# Altium schematic sheet RK3399_SDRAM_Controller.SchDoc
size A3; SheetNumber: 6; SheetTotal: 20
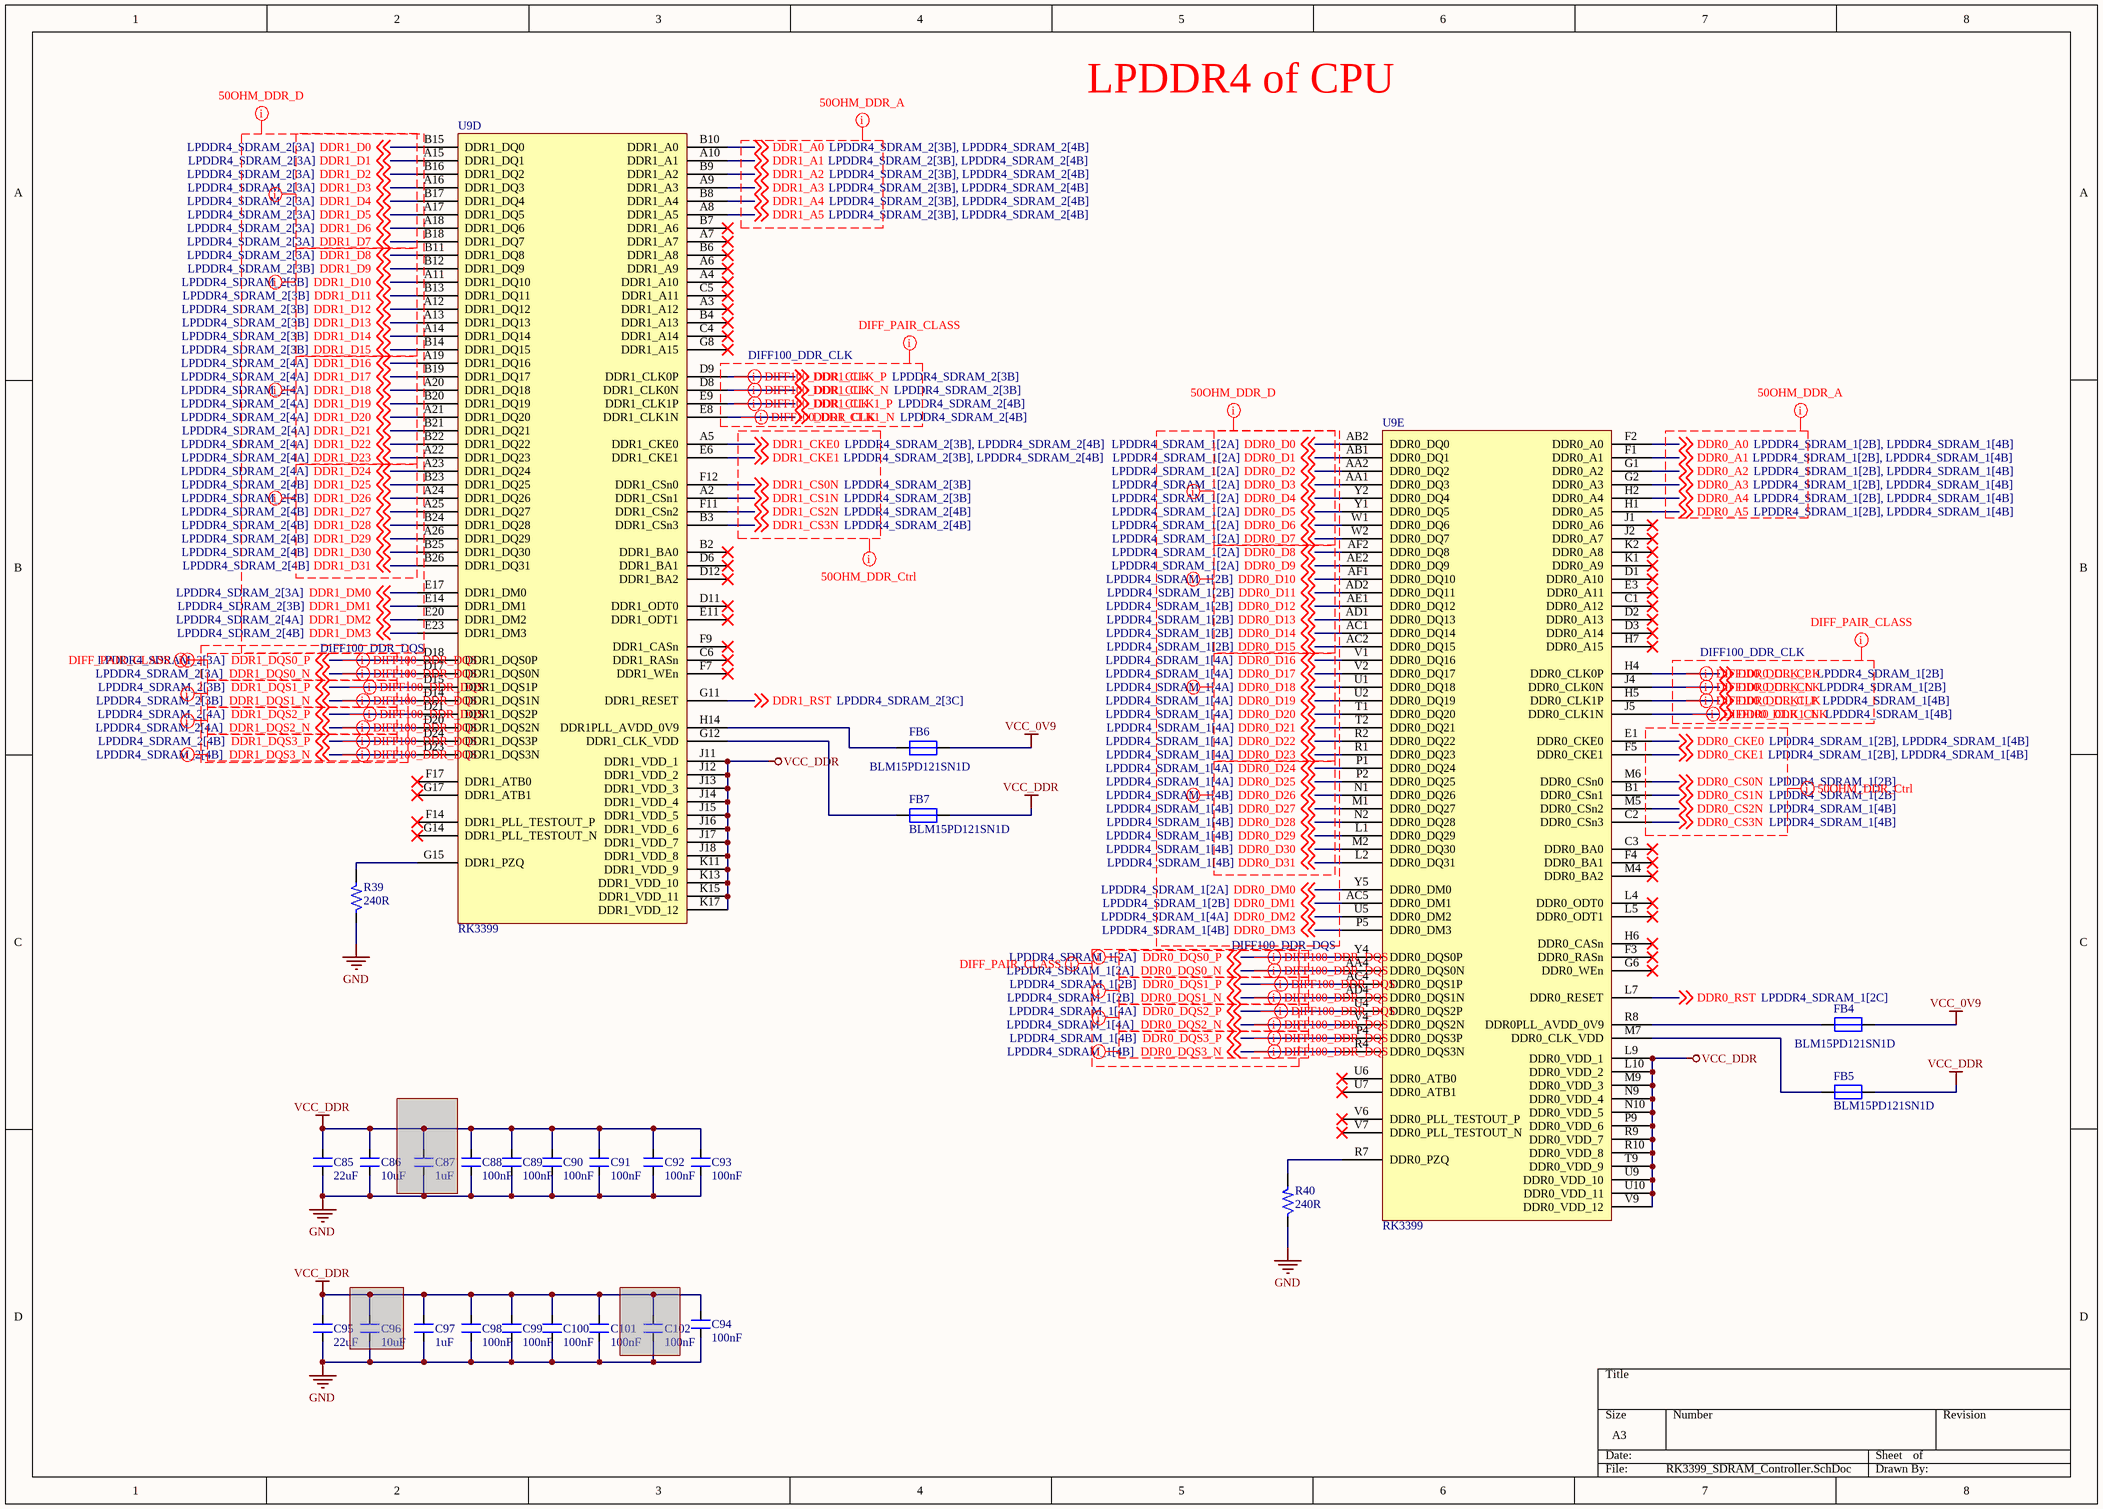
[diagram p0: RK3399_SDRAM_Controller.SchDoc]

## Parts
C85  22uF  [CAP_0402]
C86  10uF  [CAP_0402]
C87  1uF  [CAP_0201]  (masked out: inside a compile mask, not in the netlist)
C88  100nF  [CAP_0201]
C89  100nF  [CAP_0201]
C90  100nF  [CAP_0201]
C91  100nF  [CAP_0201]
C92  100nF  [CAP_0201]
C93  100nF  [CAP_0201]
C94  100nF  [CAP_0201]
C95  22uF  [CAP_0402]
C96  10uF  [CAP_0402]  (masked out: inside a compile mask, not in the netlist)
C97  1uF  [CAP_0201]
C98  100nF  [CAP_0201]
C99  100nF  [CAP_0201]
C100  100nF  [CAP_0201]
C101  100nF  [CAP_0201]
C102  100nF  [CAP_0201]  (masked out: inside a compile mask, not in the netlist)
FB4  BLM15PD121SN1D  [RES_0402]
FB5  BLM15PD121SN1D  [RES_0402]
FB6  BLM15PD121SN1D  [RES_0402]
FB7  BLM15PD121SN1D  [RES_0402]
R39  240R  [RES_0201]
R40  240R  [RES_0201]
U9  RK3399  [FBGA828_23_826X826]  (parts D,E of 24)

## Nets
GND: C85.1 C86.1 C88.1 C89.1 C90.1 C91.1 C92.1 C93.1 C94.1 C95.1 C97.1 C98.1 C99.1 C100.1 C101.1 R39.1 R40.1
VCC_0V9: FB4.2 FB6.2
VCC_DDR: C85.2 C86.2 C88.2 C89.2 C90.2 C91.2 C92.2 C93.2 C94.2 C95.2 C97.2 C98.2 C99.2 C100.2 C101.2 FB5.2 FB7.2 U9.J11(DDR1_VDD_1) U9.J12(DDR1_VDD_2) U9.J13(DDR1_VDD_3) U9.J14(DDR1_VDD_4) U9.J15(DDR1_VDD_5) U9.J16(DDR1_VDD_6) U9.J17(DDR1_VDD_7) U9.J18(DDR1_VDD_8) U9.K11(DDR1_VDD_9) U9.K13(DDR1_VDD_10) U9.K15(DDR1_VDD_11) U9.K17(DDR1_VDD_12) U9.L9(DDR0_VDD_1) U9.L10(DDR0_VDD_2) U9.M9(DDR0_VDD_3) U9.N9(DDR0_VDD_4) U9.N10(DDR0_VDD_5) U9.P9(DDR0_VDD_6) U9.R9(DDR0_VDD_7) U9.R10(DDR0_VDD_8) U9.T9(DDR0_VDD_9) U9.U9(DDR0_VDD_10) U9.U10(DDR0_VDD_11) U9.V9(DDR0_VDD_12)
DDR0_A0: U9.F2(DDR0_A0) ; off-sheet DDR0_A0
DDR0_A1: U9.F1(DDR0_A1) ; off-sheet DDR0_A1
DDR0_A2: U9.G1(DDR0_A2) ; off-sheet DDR0_A2
DDR0_A3: U9.G2(DDR0_A3) ; off-sheet DDR0_A3
DDR0_A4: U9.H2(DDR0_A4) ; off-sheet DDR0_A4
DDR0_A5: U9.H1(DDR0_A5) ; off-sheet DDR0_A5
DDR0_CKE0: U9.E1(DDR0_CKE0) ; off-sheet DDR0_CKE0
DDR0_CKE1: U9.F5(DDR0_CKE1) ; off-sheet DDR0_CKE1
DDR0_CLK1_N: U9.J5(DDR0_CLK1N) ; off-sheet DDR0_CLK1_N
DDR0_CLK1_P: U9.H5(DDR0_CLK1P) ; off-sheet DDR0_CLK1_P
DDR0_CLK_N: U9.J4(DDR0_CLK0N) ; off-sheet DDR0_CLK_N
DDR0_CLK_P: U9.H4(DDR0_CLK0P) ; off-sheet DDR0_CLK_P
DDR0_CS0N: U9.M6(DDR0_CSn0) ; off-sheet DDR0_CS0N
DDR0_CS1N: U9.B1(DDR0_CSn1) ; off-sheet DDR0_CS1N
DDR0_CS2N: U9.M5(DDR0_CSn2) ; off-sheet DDR0_CS2N
DDR0_CS3N: U9.C2(DDR0_CSn3) ; off-sheet DDR0_CS3N
DDR0_D0: U9.AB2(DDR0_DQ0) ; off-sheet DDR0_D0
DDR0_D1: U9.AB1(DDR0_DQ1) ; off-sheet DDR0_D1
DDR0_D2: U9.AA2(DDR0_DQ2) ; off-sheet DDR0_D2
DDR0_D3: U9.AA1(DDR0_DQ3) ; off-sheet DDR0_D3
DDR0_D4: U9.Y2(DDR0_DQ4) ; off-sheet DDR0_D4
DDR0_D5: U9.Y1(DDR0_DQ5) ; off-sheet DDR0_D5
DDR0_D6: U9.W1(DDR0_DQ6) ; off-sheet DDR0_D6
DDR0_D7: U9.W2(DDR0_DQ7) ; off-sheet DDR0_D7
DDR0_D8: U9.AF2(DDR0_DQ8) ; off-sheet DDR0_D8
DDR0_D9: U9.AE2(DDR0_DQ9) ; off-sheet DDR0_D9
DDR0_D10: U9.AF1(DDR0_DQ10) ; off-sheet DDR0_D10
DDR0_D11: U9.AD2(DDR0_DQ11) ; off-sheet DDR0_D11
DDR0_D12: U9.AE1(DDR0_DQ12) ; off-sheet DDR0_D12
DDR0_D13: U9.AD1(DDR0_DQ13) ; off-sheet DDR0_D13
DDR0_D14: U9.AC1(DDR0_DQ14) ; off-sheet DDR0_D14
DDR0_D15: U9.AC2(DDR0_DQ15) ; off-sheet DDR0_D15
DDR0_D16: U9.V1(DDR0_DQ16) ; off-sheet DDR0_D16
DDR0_D17: U9.V2(DDR0_DQ17) ; off-sheet DDR0_D17
DDR0_D18: U9.U1(DDR0_DQ18) ; off-sheet DDR0_D18
DDR0_D19: U9.U2(DDR0_DQ19) ; off-sheet DDR0_D19
DDR0_D20: U9.T1(DDR0_DQ20) ; off-sheet DDR0_D20
DDR0_D21: U9.T2(DDR0_DQ21) ; off-sheet DDR0_D21
DDR0_D22: U9.R2(DDR0_DQ22) ; off-sheet DDR0_D22
DDR0_D23: U9.R1(DDR0_DQ23) ; off-sheet DDR0_D23
DDR0_D24: U9.P1(DDR0_DQ24) ; off-sheet DDR0_D24
DDR0_D25: U9.P2(DDR0_DQ25) ; off-sheet DDR0_D25
DDR0_D26: U9.N1(DDR0_DQ26) ; off-sheet DDR0_D26
DDR0_D27: U9.M1(DDR0_DQ27) ; off-sheet DDR0_D27
DDR0_D28: U9.N2(DDR0_DQ28) ; off-sheet DDR0_D28
DDR0_D29: U9.L1(DDR0_DQ29) ; off-sheet DDR0_D29
DDR0_D30: U9.M2(DDR0_DQ30) ; off-sheet DDR0_D30
DDR0_D31: U9.L2(DDR0_DQ31) ; off-sheet DDR0_D31
DDR0_DM0: U9.Y5(DDR0_DM0) ; off-sheet DDR0_DM0
DDR0_DM1: U9.AC5(DDR0_DM1) ; off-sheet DDR0_DM1
DDR0_DM2: U9.U5(DDR0_DM2) ; off-sheet DDR0_DM2
DDR0_DM3: U9.P5(DDR0_DM3) ; off-sheet DDR0_DM3
DDR0_DQS0_N: U9.AA4(DDR0_DQS0N) ; off-sheet DDR0_DQS0_N
DDR0_DQS0_P: U9.Y4(DDR0_DQS0P) ; off-sheet DDR0_DQS0_P
DDR0_DQS1_N: U9.AD4(DDR0_DQS1N) ; off-sheet DDR0_DQS1_N
DDR0_DQS1_P: U9.AC4(DDR0_DQS1P) ; off-sheet DDR0_DQS1_P
DDR0_DQS2_N: U9.V4(DDR0_DQS2N) ; off-sheet DDR0_DQS2_N
DDR0_DQS2_P: U9.U4(DDR0_DQS2P) ; off-sheet DDR0_DQS2_P
DDR0_DQS3_N: U9.R4(DDR0_DQS3N) ; off-sheet DDR0_DQS3_N
DDR0_DQS3_P: U9.P4(DDR0_DQS3P) ; off-sheet DDR0_DQS3_P
DDR0_RST: U9.L7(DDR0_RESET) ; off-sheet DDR0_RST
DDR1_A0: U9.B10(DDR1_A0) ; off-sheet DDR1_A0
DDR1_A1: U9.A10(DDR1_A1) ; off-sheet DDR1_A1
DDR1_A2: U9.B9(DDR1_A2) ; off-sheet DDR1_A2
DDR1_A3: U9.A9(DDR1_A3) ; off-sheet DDR1_A3
DDR1_A4: U9.B8(DDR1_A4) ; off-sheet DDR1_A4
DDR1_A5: U9.A8(DDR1_A5) ; off-sheet DDR1_A5
DDR1_CKE0: U9.A5(DDR1_CKE0) ; off-sheet DDR1_CKE0
DDR1_CKE1: U9.E6(DDR1_CKE1) ; off-sheet DDR1_CKE1
DDR1_CLK1_N: U9.E8(DDR1_CLK1N) ; off-sheet DDR1_CLK1_N
DDR1_CLK1_P: U9.E9(DDR1_CLK1P) ; off-sheet DDR1_CLK1_P
DDR1_CLK_N: U9.D8(DDR1_CLK0N) ; off-sheet DDR1_CLK_N
DDR1_CLK_P: U9.D9(DDR1_CLK0P) ; off-sheet DDR1_CLK_P
DDR1_CS0N: U9.F12(DDR1_CSn0) ; off-sheet DDR1_CS0N
DDR1_CS1N: U9.A2(DDR1_CSn1) ; off-sheet DDR1_CS1N
DDR1_CS2N: U9.F11(DDR1_CSn2) ; off-sheet DDR1_CS2N
DDR1_CS3N: U9.B3(DDR1_CSn3) ; off-sheet DDR1_CS3N
DDR1_D0: U9.B15(DDR1_DQ0) ; off-sheet DDR1_D0
DDR1_D1: U9.A15(DDR1_DQ1) ; off-sheet DDR1_D1
DDR1_D2: U9.B16(DDR1_DQ2) ; off-sheet DDR1_D2
DDR1_D3: U9.A16(DDR1_DQ3) ; off-sheet DDR1_D3
DDR1_D4: U9.B17(DDR1_DQ4) ; off-sheet DDR1_D4
DDR1_D5: U9.A17(DDR1_DQ5) ; off-sheet DDR1_D5
DDR1_D6: U9.A18(DDR1_DQ6) ; off-sheet DDR1_D6
DDR1_D7: U9.B18(DDR1_DQ7) ; off-sheet DDR1_D7
DDR1_D8: U9.B11(DDR1_DQ8) ; off-sheet DDR1_D8
DDR1_D9: U9.B12(DDR1_DQ9) ; off-sheet DDR1_D9
DDR1_D10: U9.A11(DDR1_DQ10) ; off-sheet DDR1_D10
DDR1_D11: U9.B13(DDR1_DQ11) ; off-sheet DDR1_D11
DDR1_D12: U9.A12(DDR1_DQ12) ; off-sheet DDR1_D12
DDR1_D13: U9.A13(DDR1_DQ13) ; off-sheet DDR1_D13
DDR1_D14: U9.A14(DDR1_DQ14) ; off-sheet DDR1_D14
DDR1_D15: U9.B14(DDR1_DQ15) ; off-sheet DDR1_D15
DDR1_D16: U9.A19(DDR1_DQ16) ; off-sheet DDR1_D16
DDR1_D17: U9.B19(DDR1_DQ17) ; off-sheet DDR1_D17
DDR1_D18: U9.A20(DDR1_DQ18) ; off-sheet DDR1_D18
DDR1_D19: U9.B20(DDR1_DQ19) ; off-sheet DDR1_D19
DDR1_D20: U9.A21(DDR1_DQ20) ; off-sheet DDR1_D20
DDR1_D21: U9.B21(DDR1_DQ21) ; off-sheet DDR1_D21
DDR1_D22: U9.B22(DDR1_DQ22) ; off-sheet DDR1_D22
DDR1_D23: U9.A22(DDR1_DQ23) ; off-sheet DDR1_D23
DDR1_D24: U9.A23(DDR1_DQ24) ; off-sheet DDR1_D24
DDR1_D25: U9.B23(DDR1_DQ25) ; off-sheet DDR1_D25
DDR1_D26: U9.A24(DDR1_DQ26) ; off-sheet DDR1_D26
DDR1_D27: U9.A25(DDR1_DQ27) ; off-sheet DDR1_D27
DDR1_D28: U9.B24(DDR1_DQ28) ; off-sheet DDR1_D28
DDR1_D29: U9.A26(DDR1_DQ29) ; off-sheet DDR1_D29
DDR1_D30: U9.B25(DDR1_DQ30) ; off-sheet DDR1_D30
DDR1_D31: U9.B26(DDR1_DQ31) ; off-sheet DDR1_D31
DDR1_DM0: U9.E17(DDR1_DM0) ; off-sheet DDR1_DM0
DDR1_DM1: U9.E14(DDR1_DM1) ; off-sheet DDR1_DM1
DDR1_DM2: U9.E20(DDR1_DM2) ; off-sheet DDR1_DM2
DDR1_DM3: U9.E23(DDR1_DM3) ; off-sheet DDR1_DM3
DDR1_DQS0_N: U9.D17(DDR1_DQS0N) ; off-sheet DDR1_DQS0_N
DDR1_DQS0_P: U9.D18(DDR1_DQS0P) ; off-sheet DDR1_DQS0_P
DDR1_DQS1_N: U9.D14(DDR1_DQS1N) ; off-sheet DDR1_DQS1_N
DDR1_DQS1_P: U9.D15(DDR1_DQS1P) ; off-sheet DDR1_DQS1_P
DDR1_DQS2_N: U9.D20(DDR1_DQS2N) ; off-sheet DDR1_DQS2_N
DDR1_DQS2_P: U9.D21(DDR1_DQS2P) ; off-sheet DDR1_DQS2_P
DDR1_DQS3_N: U9.D23(DDR1_DQS3N) ; off-sheet DDR1_DQS3_N
DDR1_DQS3_P: U9.D24(DDR1_DQS3P) ; off-sheet DDR1_DQS3_P
DDR1_RST: U9.G11(DDR1_RESET) ; off-sheet DDR1_RST
NetFB4_1: FB4.1 U9.R8(DDR0PLL_AVDD_0V9)
NetFB5_1: FB5.1 U9.M7(DDR0_CLK_VDD)
NetFB6_1: FB6.1 U9.H14(DDR1PLL_AVDD_0V9)
NetFB7_1: FB7.1 U9.G12(DDR1_CLK_VDD)
NetR39_2: R39.2 U9.G15(DDR1_PZQ)
NetR40_2: R40.2 U9.R7(DDR0_PZQ)

Not connected (* = marked no-connect by the designer): U9 A3(DDR1_A12)* A4(DDR1_A10)* A6(DDR1_A9)* A7(DDR1_A7)* B2(DDR1_BA0)* B4(DDR1_A13)* B6(DDR1_A8)* B7(DDR1_A6)* C1(DDR0_A12)* C3(DDR0_BA0)* C4(DDR1_A14)* C5(DDR1_A11)* C6(DDR1_RASn)* D1(DDR0_A10)* D2(DDR0_A13)* D3(DDR0_A14)* D6(DDR1_BA1)* D11(DDR1_ODT0)* D12(DDR1_BA2)* E3(DDR0_A11)* E11(DDR1_ODT1)* F3(DDR0_RASn)* F4(DDR0_BA1)* F7(DDR1_WEn)* F9(DDR1_CASn)* F14(DDR1_PLL_TESTOUT_P)* F17(DDR1_ATB0)* G6(DDR0_WEn)* G8(DDR1_A15)* G14(DDR1_PLL_TESTOUT_N)* G17(DDR1_ATB1)* H6(DDR0_CASn)* H7(DDR0_A15)* J1(DDR0_A6)* J2(DDR0_A7)* K1(DDR0_A9)* K2(DDR0_A8)* L4(DDR0_ODT0)* L5(DDR0_ODT1)* M4(DDR0_BA2)* U6(DDR0_ATB0)* U7(DDR0_ATB1)* V6(DDR0_PLL_TESTOUT_P)* V7(DDR0_PLL_TESTOUT_N)*

## Layout directives
net class DDR_G-1: DDR0_D0, DDR0_D1, DDR0_D2, DDR0_D3, DDR0_D4, DDR0_D5, DDR0_D6, DDR0_D7, DDR0_DQS0_N, DDR0_DQS0_P, DDR1_D0, DDR1_D1, DDR1_D2, DDR1_D3, DDR1_D4, DDR1_D5, DDR1_D6, DDR1_D7, DDR1_DQS0_N, DDR1_DQS0_P
net class DDR_G-2: DDR0_D8, DDR0_D9, DDR0_D10, DDR0_D11, DDR0_D12, DDR0_D13, DDR0_D14, DDR0_D15, DDR0_DQS1_N, DDR0_DQS1_P, DDR1_D8, DDR1_D9, DDR1_D10, DDR1_D11, DDR1_D12, DDR1_D13, DDR1_D14, DDR1_D15, DDR1_DQS1_N, DDR1_DQS1_P
net class DDR_G-3: DDR0_D16, DDR0_D17, DDR0_D18, DDR0_D19, DDR0_D20, DDR0_D21, DDR0_D22, DDR0_D23, DDR0_DQS2_N, DDR0_DQS2_P, DDR1_D16, DDR1_D17, DDR1_D18, DDR1_D19, DDR1_D20, DDR1_D21, DDR1_D22, DDR1_D23, DDR1_DQS2_N, DDR1_DQS2_P
net class DDR_G-4: DDR0_D24, DDR0_D25, DDR0_D26, DDR0_D27, DDR0_D28, DDR0_D29, DDR0_D30, DDR0_D31, DDR0_DQS3_N, DDR0_DQS3_P, DDR1_D24, DDR1_D25, DDR1_D26, DDR1_D27, DDR1_D28, DDR1_D29, DDR1_D30, DDR1_D31, DDR1_DQS3_N, DDR1_DQS3_P
net class 50OHM_DDR_D: DDR0_D0, DDR0_D1, DDR0_D2, DDR0_D3, DDR0_D4, DDR0_D5, DDR0_D6, DDR0_D7, DDR0_D8, DDR0_D9, DDR0_D10, DDR0_D11, DDR0_D12, DDR0_D13, DDR0_D14, DDR0_D15, DDR0_D16, DDR0_D17, DDR0_D18, DDR0_D19, DDR0_D20, DDR0_D21, DDR0_D22, DDR0_D23, DDR0_D24, DDR0_D25, DDR0_D26, DDR0_D27, DDR0_D28, DDR0_D29, DDR0_D30, DDR0_D31, DDR0_DM0, DDR0_DM1, DDR0_DM2, DDR0_DM3, DDR1_D0, DDR1_D1, DDR1_D2, DDR1_D3, DDR1_D4, DDR1_D5, DDR1_D6, DDR1_D7, DDR1_D8, DDR1_D9, DDR1_D10, DDR1_D11, DDR1_D12, DDR1_D13, DDR1_D14, DDR1_D15, DDR1_D16, DDR1_D17, DDR1_D18, DDR1_D19, DDR1_D20, DDR1_D21, DDR1_D22, DDR1_D23, DDR1_D24, DDR1_D25, DDR1_D26, DDR1_D27, DDR1_D28, DDR1_D29, DDR1_D30, DDR1_D31, DDR1_DM0, DDR1_DM1, DDR1_DM2, DDR1_DM3
net class 50OHM_DDR_A: DDR0_A0, DDR0_A1, DDR0_A2, DDR0_A3, DDR0_A4, DDR0_A5, DDR1_A0, DDR1_A1, DDR1_A2, DDR1_A3, DDR1_A4, DDR1_A5
net class 50OHM_DDR_Ctrl: DDR0_CKE0, DDR0_CKE1, DDR0_CS0N, DDR0_CS1N, DDR0_CS2N, DDR0_CS3N, DDR1_CKE0, DDR1_CKE1, DDR1_CS0N, DDR1_CS1N, DDR1_CS2N, DDR1_CS3N
differential pair; differential pair class DIFF100_DDR_CLK: DDR0_CLK1_N, DDR0_CLK1_P, DDR0_CLK_N, DDR0_CLK_P, DDR1_CLK1_N, DDR1_CLK1_P, DDR1_CLK_N, DDR1_CLK_P
net class DIFF_PAIR_CLASS: DDR0_CLK1_N, DDR0_CLK1_P, DDR0_CLK_N, DDR0_CLK_P, DDR0_DQS0_N, DDR0_DQS0_P, DDR0_DQS1_N, DDR0_DQS1_P, DDR0_DQS2_N, DDR0_DQS2_P, DDR0_DQS3_N, DDR0_DQS3_P, DDR1_CLK1_N, DDR1_CLK1_P, DDR1_CLK_N, DDR1_CLK_P, DDR1_DQS0_N, DDR1_DQS0_P, DDR1_DQS1_N, DDR1_DQS1_P, DDR1_DQS2_N, DDR1_DQS2_P, DDR1_DQS3_N, DDR1_DQS3_P
differential pair; differential pair class DIFF100_DDR_DQS: DDR0_DQS0_N, DDR0_DQS0_P, DDR0_DQS1_N, DDR0_DQS1_P, DDR0_DQS2_N, DDR0_DQS2_P, DDR0_DQS3_N, DDR0_DQS3_P, DDR1_DQS0_N, DDR1_DQS0_P, DDR1_DQS1_N, DDR1_DQS1_P, DDR1_DQS2_N, DDR1_DQS2_P, DDR1_DQS3_N, DDR1_DQS3_P

## Notes on the sheet
- LPDDR4 of CPU

## Library data of the parts
C85 C95 = CAP_22uF-6.3V-20%-0402: 22µF ±20% 6.3V Ceramic Capacitor X5R 0402 (1005 Metric); Manufacturer: Murata Electronics; Manufacturer Part Number: CL05A226MQ5N6J8; Case/Package: 0402; Supplier-1: Digikey
C86 C96 = CAP_10uF-10V-20%-0402: 10µF ±20% 10V Ceramic Capacitor X5R 0402 (1005 Metric); Manufacturer Part Number: CL05A106MP5NUNC; Manufacturer: Samsung Electro-Mechanics; Case/Package: 0402; Supplier-1: Digikey
C87 C97 = CAP_1uF-16V-10%-0201: 1µF ±20% 16V Ceramic Capacitor X5R 0201 (0603 Metric); Manufacturer: Samsung Electro-Mechanics; Manufacturer Part Number: CL03A105MO3NRNH; Case/Package: 0201; Supplier-1: Digikey
C88-C94 C98-C102 = CAP_100nF-25V-10%-0201: 0.1µF ±10% 25V Ceramic Capacitor X5R 0201 (0603 Metric); Manufacturer: TDK Corporation; Manufacturer Part Number: C0603X5R1E104K030BB; Case/Package: 0201; Supplier-1: Digikey
FB4-FB7 = FB_120R-1.3A-100Mhz-0402: 120 Ohms @ 100MHz 1 Power Line Ferrite Bead 0402 (1005 Metric) 1.3A 90mOhm; Manufacturer: Murata Electronics; Mnaufacturer Part Number: BLM15PD121SN1D; Case/Package: 0402; Supplier-1: Digikey
R39 R40 = RES_240R-0.05W-1%-0201: 240 Ohms ±1% 0.05W, 1/20W Chip Resistor 0201 (0603 Metric) Thick Film; Manufacturer: Yageo; Manufacturer Part Number: RC0201FR-07240RL; Case/Package: 0201; Supplier-1: Digikey
U9 = IC_RK3399-FCBGA828: RK3399 is a low power, high performance processor for computing, personal mobile.; Manufacturer: Rockchip; Manufacturer Part Number: RK3399; Case/Package: FCBGA828; Supplier-1: Rockchip